# Altium schematic sheet 01-POWER.SchDoc: *NGUON4V4
size A3; SheetNumber: 2; SheetTotal: 7
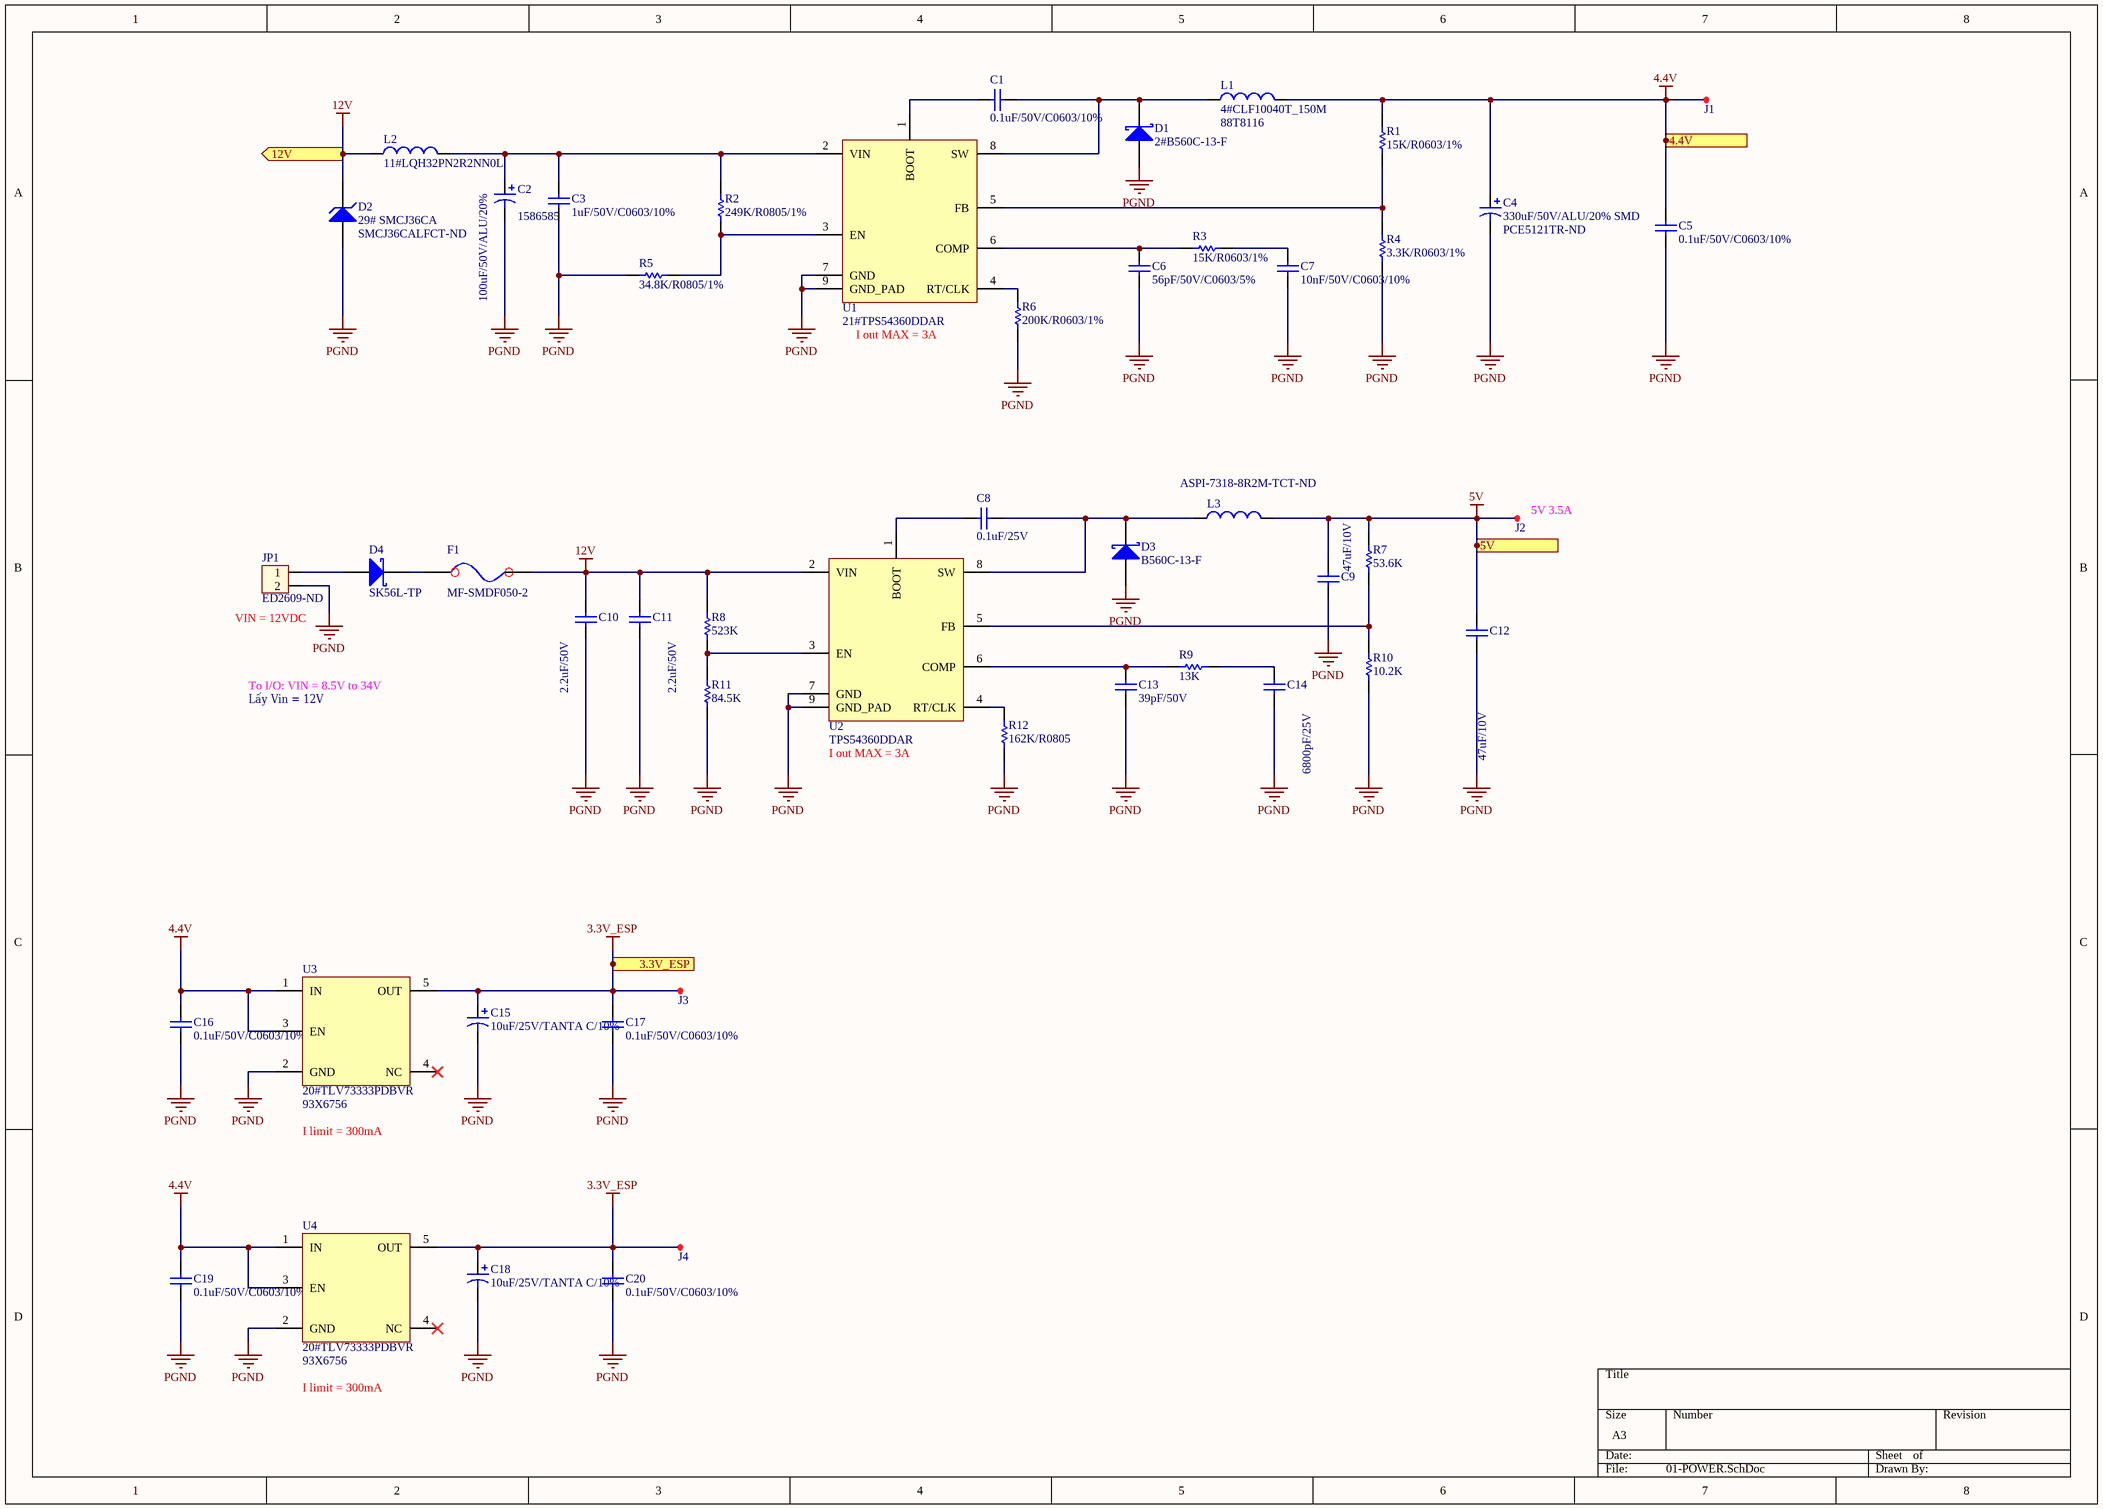
[diagram p0: 01-POWER.SchDoc]

## Parts
C1  0.1uF/50V/C0603/10%  [Cap Ceramic 0603 SMD]
C2  100uF/50V/ALU/20%  Supplier Part Number 1: 1586585  [CAP ALU CASE F SMD]
C3  1uF/50V/C0603/10%  [Cap Ceramic 0603 SMD]
C4  330uF/50V/ALU/20% SMD  Supplier Part Number 1: PCE5121TR-ND  [CAP ALU CASE G SMD]
C5  0.1uF/50V/C0603/10%  [Cap Ceramic 0603 SMD]
C6  56pF/50V/C0603/5%  [Cap Ceramic 0603 SMD]
C7  10nF/50V/C0603/10%  [Cap Ceramic 0603 SMD]
C8  0.1uF/25V  [CAP_CERA_C2012(CC0805INCH)]
C9  47uF/10V  [CAP_CERA_C2012(CC0805INCH)]
C10  2.2uF/50V  [CAP_CERA_C2012(CC0805INCH)]
C11  2.2uF/50V  [CAP_CERA_C2012(CC0805INCH)]
C12  47uF/10V  [CAP_CERA_C2012(CC0805INCH)]
C13  39pF/50V  [CAP_CERA_C2012(CC0805INCH)]
C14  6800pF/25V  [CAP_CERA_C2012(CC0805INCH)]
C15  10uF/25V/TANTA C/10%  [CAP TANT CASE C SMD]
C16  0.1uF/50V/C0603/10%  [Cap Ceramic 0603 SMD]
C17  0.1uF/50V/C0603/10%  [Cap Ceramic 0603 SMD]
C18  10uF/25V/TANTA C/10%  [CAP TANT CASE C SMD]
C19  0.1uF/50V/C0603/10%  [Cap Ceramic 0603 SMD]
C20  0.1uF/50V/C0603/10%  [Cap Ceramic 0603 SMD]
D1  2#B560C-13-F  [2# B560C]
D2  29# SMCJ36CA  Supplier Part Number 1: SMCJ36CALFCT-ND  [29# diode SMCJ36A]
D3  B560C-13-F  [2# B560C]
D4  SK56L-TP  [30# SK56L-TPMSCT-ND]
F1  MF-SMDF050-2  [13# MF-SMDF050]
J1  TEST POINT  [TEST POINT 1mm]  (value not drawn)
J2  TEST POINT  [TEST POINT 1mm]  (value not drawn)
J3  TEST POINT  [TEST POINT 1mm]  (value not drawn)
J4  TEST POINT  [TEST POINT 1mm]  (value not drawn)
JP1  ED2609-ND  [DOMINO_OSTTC_2P]
L1  4#CLF10040T_150M  Supplier Part Number 1: 88T8116  [4# clf10040XX]
L2  11#LQH32PN2R2NN0L  [11# LQH32PN2R2]
L3  ASPI-7318-8R2M-TCT-ND  [ASPI-7318-8R2M-TCT-ND]
R1  15K/R0603/1%  [Res 0603 SMD]
R2  249K/R0805/1%  [Res 0805 SMD]
R3  15K/R0603/1%  [Res 0603 SMD]
R4  3.3K/R0603/1%  [Cap Ceramic 0603 SMD]
R5  34.8K/R0805/1%  [Res 0805 SMD]
R6  200K/R0603/1%  [Res 0603 SMD]
R7  53.6K  [Res 0805 SMD]
R8  523K  [Res 0805 SMD]
R9  13K  [Res 0805 SMD]
R10  10.2K  [Res 0805 SMD]
R11  84.5K  [Res 0805 SMD]
R12  162K/R0805  [Res 0805 SMD]
U1  21#TPS54360DDAR  [21# TPS54360]
U2  TPS54360DDAR  [21# TPS54360]
U3  20#TLV73333PDBVR  Supplier Part Number 1: 93X6756  [TLV73333PDBVR - SOT23-65]
U4  20#TLV73333PDBVR  Supplier Part Number 1: 93X6756  [TLV73333PDBVR - SOT23-65]

## Ports
3.3V_ESP (out), 4.4V (out), 5V (out), 12V (out)

## Nets
3.3V_ESP: C15.1 C17.2 C18.1 C20.2 J3.1(TP) J4.1(TP) U3.5(OUT) U4.5(OUT) ; port 3.3V_ESP
4.4V: C4.1 C5.2 C16.2 C19.2 J1.1(TP) L1.2 R1.2 U3.1(IN) U3.3(EN) U4.1(IN) U4.3(EN) ; port 4.4V
5V: C9.2 C12.2 J2.1(TP) L3.2 R7.2 ; port 5V
12V: C10.2 C11.2 D2.2(K) F1.2(OUT) L2.1 R8.2 U2.2(VIN) ; port 12V
PGND: C2.2 C3.1 C4.2 C5.1 C6.1 C7.1 C9.1 C10.1 C11.1 C12.1 C13.1 C14.1 C15.2 C16.1 C17.1 C18.2 C19.1 C20.1 D1.1(A) D2.1(A) D3.1(A) JP1.2 R4.1 R5.1 R6.2 R10.1 R11.1 R12.2 U1.7(GND) U1.9(GND_PAD) U2.7(GND) U2.9(GND_PAD) U3.2(GND) U4.2(GND)
NetC1_1: C1.1 U1.1(BOOT)
NetC1_2: C1.2 D1.2(K) L1.1 U1.8(SW)
NetC2_1: C2.1 C3.2 L2.2 R2.2 U1.2(VIN)
NetC6_2: C6.2 R3.2 U1.6(COMP)
NetC7_2: C7.2 R3.1
NetC8_1: C8.1 D3.2(K) L3.1 U2.8(SW)
NetC8_2: C8.2 U2.1(BOOT)
NetC13_2: C13.2 R9.2 U2.6(COMP)
NetC14_2: C14.2 R9.1
NetD4_1: D4.1(A) JP1.1
NetD4_2: D4.2(K) F1.1(IN)
NetR1_1: R1.1 R4.2 U1.5(FB)
NetR2_1: R2.1 R5.2 U1.3(EN)
NetR6_1: R6.1 U1.4(RT/CLK)
NetR7_1: R7.1 R10.2 U2.5(FB)
NetR8_1: R8.1 R11.2 U2.3(EN)
NetR12_1: R12.1 U2.4(RT/CLK)

Not connected (* = marked no-connect by the designer): U3 4(NC)*; U4 4(NC)*

## Notes on the sheet
- (near U1) I out MAX = 3A
- (near J2) 5V 3.5A
- (near JP1) VIN = 12VDC
- To I/O: VIN = 8.5V to 34V
- Lấy Vin = 12V
- (near U2) I out MAX = 3A
- I limit = 300mA
- Title
- Size:
- Date:
- A3
- Number:
- Time:
- Revision:
- Sheet
- of
- File:

## Library data of the parts
C1 C5 C16 C17 C19 C20 = 0.1uF/50V/C0603/10%: CAP CER 0.1UF 50V 10% X7R 0603; Manufacturer: Murata Electronics North America; Manufacturer Part Number: GRM188R71H104KA93D; Capacitance: 0.1µF; RoHS: RoHS Compliant; Category: Capacitors; Packaging: Tape & Reel (TR); Tolerance: ±10%; Voltage - Rated: 50V; Temperature Coefficient: X7R; Mounting Type: Surface Mount, MLCC; Operating Temperature: -55°C ~ 125°C; Applications: General Purpose; Ratings: -; Package / Case: 0603 (1608 Metric); Size / Dimension: 0.063" L x 0.031" W (1.60mm x 0.80mm); Height - Seated (Max): -; Thickness (Max): 0.035" (0.90mm); Lead Spacing: -; Features: -; Lead Style: -; ComponentLink1URL: http://www.murata.com/~/media/webrenewal/support/library/catalog/products/capacitor/mlcc/c02e.ashx; ComponentLink1Description: http://www.murata.com/~/media/webrenewal/support/library/catalog/products/capacitor/mlcc/c02e.ashx; Supplier 1: Digi-Key; Supplier Part Number 1: 490-1519-1-ND
C2 = 100uF/50V/ALU 8X11.5/20%: CAP ALU 100UF 20% 50V RADIAL; Manufacturer: Panasonic Electronic Components; Manufacturer Part Number: ECA-1HM101B; Capacitance: 100µF; Lifetime @ Temp.: 2000 Hrs @ 85°C; Ripple Current: 250mA; RoHS: RoHS Compliant; Category: Capacitors; Packaging: Tape & Box (TB); Tolerance: ±20%; Voltage Rating: 50V; ESR (Equivalent Series Resistance): -; Operating Temperature: -40°C ~ 85°C; Type: -; Applications: General Purpose; Impedance: -; Lead Spacing: 0.197" (5.00mm); Size / Dimension: 0.315" Dia (8.00mm); Height - Seated (Max): 0.492" (12.50mm); Surface Mount Land Size: -; Mounting Type: Through Hole; Package / Case: Radial, Can; ComponentLink1URL: http://industrial.panasonic.com/www-cgi/jvcr13pz.cgi?E+PZ+3+ABA0012+ECA1HM101B+7+WW; ComponentLink1Description: http://industrial.panasonic.com/www-cgi/jvcr13pz.cgi?E+PZ+3+ABA0012+ECA1HM101B+7+WW; Supplier 1: Future Electronics
C3 = 1uF/50V/C0603/10%: CAP CER 1UF 50V X7R 0603; Manufacturer: Samsung Electro-Mechanics America, Inc.; Manufacturer Part Number: CL21B105KBFNNNE; Capacitance: 1µF; Tolerance: ±10%; RoHS: RoHS Compliant; Category: Capacitors; Packaging: Cut Tape (CT); Voltage - Rated: 50V; Temperature Coefficient: X7R; Mounting Type: Surface Mount, MLCC; Operating Temperature: -55°C ~ 125°C; Applications: General Purpose; Ratings: -; Package / Case: 0805 (2012 Metric); Size / Dimension: 0.079" L x 0.049" W (2.00mm x 1.25mm); Height - Seated (Max): -; Thickness (Max): 0.053" (1.35mm); Lead Spacing: -; Features: -; Lead Style: -; ComponentLink1URL: http://www.samsungsem.com/kr/support/product-search/mlcc/CL21B105KBFNNNE.jsp; ComponentLink1Description: http://www.samsungsem.com/kr/support/product-search/mlcc/CL21B105KBFNNNE.jsp; Supplier 1: Digi-Key; Supplier Part Number 1: 1276-1029-1-ND
C4 = 330uF/50V/ALU12.5X20mm/20%/7000Hrs: CAP ALU 330UF 20% 50V SMD; Manufacturer: Nichicon; Manufacturer Part Number: UPW1J331MHD; Lifetime @ Temp.: 7000 Hrs @ 105°C; Polarization: Polar; Ripple Current - Low Frequency: 838.5mA @ 120Hz; Ripple Current - High Frequency: 1.29A @ 100kHz; RoHS: RoHS Compliant; Category: Capacitors; Packaging: Bulk; Part Status: Active; Tolerance: ±20%; ESR (Equivalent Series Resistance): -; Operating Temperature: -55°C ~ 105°C; Applications: General Purpose; Lead Spacing: 0.197" (5.00mm); Size / Dimension: 0.492" Dia (12.50mm); Height - Seated (Max): 0.787" (20.00mm); Surface Mount Land Size: -; Mounting Type: Through Hole; Package / Case: Radial, Can; ComponentLink1URL: http://nichicon-us.com/english/products/pdfs/e-upw.pdf; ComponentLink1Description: http://nichicon-us.com/english/products/pdfs/e-upw.pdf; Supplier 1: Digi-Key
C6 = 56pF/50V/C0603/5%: Cap Ceramic 56pF 50V C0G 5% SMD 0603 125C Paper T/R; Manufacturer: Samsung; Manufacturer Part Number: CL10C560JB8NNNC; Temperature Coefficient: 30ppm/°C; Supplier 1: Digi-Key; Stock 1: 40000; Pricing 1: 1=0.1, 10=0.056, 100=0.0251, 500=0.0179, 1000=0.0141 (USD); Mount: Surface Mount; Case/Package: 0603; Case Code (Metric): 1608; Case Code (Imperial): 0603; Material: Ceramic; Min Operating Temperature: -55°C; Max Operating Temperature: 125°C; Capacitance: 56pF; Tolerance: 5%; Packaging: Tape and Reel; Voltage Rating: 50V; Package Quantity: 1; Dielectric: C0G; Voltage: 50V; Termination: SMD/SMT; Voltage Rating (DC): 50V; Length: 1.6mm; Height: 0.8mm; Width: 0.031inch; Thickness: 0.035inch; Depth: 0.8mm; Radiation Hardening: No; Lead Free: Lead Free; Supplier Part Number 1: 1276-1197-1-ND
C7 = 10nF/50V/C0603/10%: CAP CER 10000PF 50V X7R 0603; Manufacturer: Murata Electronics North America; Manufacturer Part Number: GRM188R71H103KA01D; Tolerance: ±10%; RoHS: RoHS Compliant; Category: Capacitors; Packaging: Cut Tape (CT); Capacitance: 10000pF; Voltage - Rated: 50V; Temperature Coefficient: X7R; Mounting Type: Surface Mount, MLCC; Operating Temperature: -55°C ~ 125°C; Applications: General Purpose; Ratings: -; Package / Case: 0603 (1608 Metric); Size / Dimension: 0.063" L x 0.031" W (1.60mm x 0.80mm); Height - Seated (Max): -; Thickness (Max): 0.035" (0.90mm); Lead Spacing: -; Features: -; Lead Style: -; ComponentLink1URL: http://www.murata.com/~/media/webrenewal/support/library/catalog/products/capacitor/mlcc/c02e.ashx; ComponentLink1Description: http://www.murata.com/~/media/webrenewal/support/library/catalog/products/capacitor/mlcc/c02e.ashx; Supplier 1: Digi-Key; Supplier Part Number 1: 490-1512-1-ND
C8 = 0.1uF/50V/C0603/10%: 0.1µF ±10% 25V Ceramic Capacitor X7R 0805 (2012 Metric); Manufacturer: AVX Corporation; ComponentLink1URL: http://www.murata.com/~/media/webrenewal/support/library/catalog/products/capacitor/mlcc/c02e.ashx; ComponentLink1Description: http://www.murata.com/~/media/webrenewal/support/library/catalog/products/capacitor/mlcc/c02e.ashx; Digikey: 478-3755-1-ND
C9 C12 = 0.1uF/50V/C0603/10%: 47µF ±20% 10V Ceramic Capacitor X5R 0805 (2012 Metric); Manufacturer: Murata; ComponentLink1URL: http://www.murata.com/~/media/webrenewal/support/library/catalog/products/capacitor/mlcc/c02e.ashx; ComponentLink1Description: http://www.murata.com/~/media/webrenewal/support/library/catalog/products/capacitor/mlcc/c02e.ashx; Digikey: 490-9961-1-ND
C10 C11 = 1uF/50V/C0603/10%: 2.2µF ±10% 50V Ceramic Capacitor JB 0805 (2012 Metric); Manufacturer: TDK; ComponentLink1URL: http://www.samsungsem.com/kr/support/product-search/mlcc/CL21B105KBFNNNE.jsp; ComponentLink1Description: http://www.samsungsem.com/kr/support/product-search/mlcc/CL21B105KBFNNNE.jsp; Digikey: 445-11501-1-ND
C13 = 56pF/50V/C0603/5%: 39pF ±10% 50V Ceramic Capacitor C0G, NP0 0805 (2012 Metric); Manufacturer: KEMET; Digikey: 399-9232-1-ND
C14 = 10nF/50V/C0603/10%: 6800pF ±10% 25V Ceramic Capacitor X7R 0805 (2012 Metric); Manufacturer: Wurth Electronics Inc.; ComponentLink1URL: http://www.murata.com/~/media/webrenewal/support/library/catalog/products/capacitor/mlcc/c02e.ashx; ComponentLink1Description: http://www.murata.com/~/media/webrenewal/support/library/catalog/products/capacitor/mlcc/c02e.ashx; Digikey: 732-8054-1-ND
C15 C18 = TAJB106M025RNJ: Tantalum Capacitors - Solid SMD 25v 10uF 20%Tol Code C; Manufacturer: Kyocera AVX; Tolerance: 20%; ESR (Equivalent Series Resistance): 2.5R; Leakage Current: 2.5uA; Polarity: Polar; Dissipation Factor: 6%; Supplier 1: Digi-Key; Manufacturer Part Number: TAJB106M025RNJ; Stock 1: 10615; Pricing 1: 1=0.74, 10=0.524, 100=0.3453, 500=0.2558, 1000=0.2174 (USD); Mount: Surface Mount; Case/Package: 1210; Weight: 0.000564oz; Case Code (Metric): 3528; Case Code (Imperial): 1210; Min Operating Temperature: -55°C; Max Operating Temperature: 125°C; Packaging: Tape and Reel; Capacitance: 10uF; Voltage Rating: 25V; Package Quantity: 2000; Termination: SMD/SMT; Voltage Rating (DC): 25V; Features: General Purpose; Length: 3.5mm; Height: 2.1mm; Width: 0.11inch; Height - Seated (Max): 0.083inch; Depth: 2.8mm; Lead Free: Lead Free; Supplier Part Number 1: 478-8887-1-ND
D1 = 2#B560C-13-F: DIODE SCHOTTKY 60V 5A SMC; Manufacturer: Diodes; Peak Reverse Current: 500uA; Forward Voltage: 700mV; Max Forward Surge Current (Ifsm): 100A; Element Configuration: Single; Polarity: Standard; Capacitance: 300pF; Supplier 1: Digi-Key; Manufacturer Part Number: B560C-13-F; Stock 1: 183351; Pricing 1: 1=0.55, 10=0.467, 100=0.349, 500=0.2742, 1000=0.2119 (USD); Mount: Surface Mount; Case/Package: SMC; Number of Pins: 2; Weight: 0.007408oz; Contact Plating: Matte,Tin; Min Operating Temperature: -55°C; Max Operating Temperature: 125°C; Package Quantity: 3000; Packaging: Tape and Reel; Forward Current: 5A; Max Repetitive Reverse Voltage (Vrrm): 60V; Average Rectified Current: 5A; Peak Non-Repetitive Surge Current: 100A; Termination: SMD/SMT; Voltage Rating (DC): 60V; Current Rating: 5A; Output Current: 5A; Max Reverse Voltage (DC): 60V; Length: 7.11mm; Height: 2.5mm; Width: 6.22mm; Radiation Hardening: No; REACH SVHC: No SVHC; Lead Free: Lead Free; Supplier Part Number 1: B560C-FDICT-ND
D2 = 29# SMCJ36CA: TVS DIODE 36VWM 58.1VC SMC; Manufacturer: Littelfuse; Direction: Bidirectional; Reverse Breakdown Voltage: 40V; Operating Supply Voltage: 36V; Max Surge Current: 25.9A; Number of Bidirectional Channels: 1; Clamping Voltage: 58.1V; Peak Pulse Power: 1.5kW; Power Line Protection: No; Test Current: 1mA; Max Breakdown Voltage: 44.2V; Max Power Dissipation: 6.5W; Leakage Current: 1uA; Supplier 1: Digi-Key; Manufacturer Part Number: SMCJ36CA; Stock 1: 75326; Pricing 1: 1=0.7, 10=0.587, 25=0.514, 100=0.4406, 250=0.3818, 500=0.3231, 1000=0.2497 (USD); Mount: Surface Mount; Number of Pins: 2; Min Operating Temperature: -55°C; Max Operating Temperature: 150°C; Package Quantity: 3000; Packaging: Tape and Reel; Reverse Standoff Voltage: 36V; Min Breakdown Voltage: 40V; Breakdown Voltage: 40V; Number of Channels: 1; Polarity: Bidirectional; Termination: SMD/SMT; Number of Elements: 1; Peak Pulse Current: 25.9A; Power Dissipation: 1.5kW; Voltage Rating (DC): 36V; Composition: Zener; Length: 8.13mm; Height: 2.62mm; Width: 6.22mm; Radiation Hardening: No; REACH SVHC: No SVHC; Lead Free: Lead Free
D3 = 2#B560C-13-F: DIODE SCHOTTKY 60V 5A SMC; Digikey: B560C-FDICT-ND
D4 = 30# SK56L-TP: DIODE SCHOTTKY 60V 5A DO214AB; ComponentLink1URL: http://www.mccsemi.com/up_pdf/SK52L-SK510L(DO-214AB).PDF; ComponentLink1Description: http://www.mccsemi.com/up_pdf/SK52L-SK510L(DO-214AB).PDF; Digikey: SK56L-TPMSCT-ND
F1 = 13#MF-SMDF050-2: PTC RESET FUSE 60V 550MA 2018; Digikey: MF-SMDF050-2CT-ND
J1-J4 = PAD 1mm: TPoint
JP1 = Con2: 2 Position Wire to Board Terminal Block Horizontal with Board 0.200" (5.08mm) Through Hole; Value: Connector 2; Digikey: ED2609-ND
L1 = 4#CLF10040T_150M: FIXED IND 15uH 3.2A 40 MOHM (10.0×9.7×3.8); Supplier 1: Newark
L2 = 11#LQH32PN2R2NN0L: Inductor Power Chip Shielded Wirewound 2.2uH 30% 1MHz Ferrite 1.6A 91.2mOhm DCR 1210 Embossed T/R; Manufacturer: Murata; Self Resonant Frequency: 70MHz; Saturation Current: 1.55A; DC Resistance (DCR): 76mR; Supplier 1: Digi-Key; Manufacturer Part Number: LQH32PN2R2NN0L; Stock 1: 21482; Pricing 1: 1=0.41, 10=0.361, 100=0.2483, 500=0.2122, 1000=0.1625 (USD); Mount: Surface Mount; Case/Package: 1210; Weight: 0.001552oz; Core Material: Ferrite; Case Code (Metric): 3225; Case Code (Imperial): 1210; Min Operating Temperature: -40°C; Max Operating Temperature: 85°C; Tolerance: 30%; Packaging: Tape and Reel; Shielding: Shielded; Package Quantity: 1; Current Rating: 1.6A; Inductance: 2.2uh; Max DC Current: 1.55A; Termination: SMD/SMT; Composition: Wirewound; Test Frequency: 1MHz; DC Current: 1.6A; Military Standard: Not; Inductance Tolerance: 30%; Length: 3.2mm; Height: 2mm; Width: 2.5mm; Height - Seated (Max): 0.067inch; Depth: 2.8mm; Radiation Hardening: No; REACH SVHC: No SVHC; Lead Free: Lead Free; Supplier Part Number 1: 490-5336-1-ND
L3 = Inductor: 8.2µH Shielded Wirewound Inductor 4A 68 mOhm Max Nonstandard; Digikey: ASPI-7318-8R2M-TCT-ND
R1 R3 = 15K/R0603/1%: RES SMD 15K OHM 1% 1/10W 0603; Manufacturer: Yageo; Manufacturer Part Number: RC0603FR-0715KL; Power (Watts): 0.1W, 1/10W; Temperature Coefficient: ±100ppm/°C; RoHS: RoHS Compliant; Category: Resistors; Packaging: Digi-Reel®; Resistance (Ohms): 15k; Tolerance: ±1%; Composition: Thick Film; Features: Moisture Resistant; Operating Temperature: -55°C ~ 155°C; Package / Case: 0603 (1608 Metric); Supplier Device Package: 0603; Size / Dimension: 0.063" L x 0.031" W (1.60mm x 0.80mm); Height: 0.022" (0.55mm); Number of Terminations: 2; ComponentLink1URL: http://www.yageo.com/NewPortal/yageodocoutput?fileName=/pdf/R-Chip/PYu-RC_Group_51_RoHS_L_3.pdf; ComponentLink1Description: http://www.yageo.com/NewPortal/yageodocoutput?fileName=/pdf/R-Chip/PYu-RC_Group_51_RoHS_L_3.pdf; Supplier 1: Digi-Key; Supplier Part Number 1: 311-15.0KHRCT-ND
R2 = 249K/R0805/1%: RES SMD 249K OHM 1% 1/10W 0805; Manufacturer: Yageo; Manufacturer Part Number: RC0603FR-07249KL; Power (Watts): 0.1W, 1/10W; Temperature Coefficient: ±100ppm/°C; Supplier 1: Digi-Key; RoHS: RoHS Compliant; Category: Resistors; Stock 1: 370515; Pricing 1: 1=0.1, 10=0.015, 100=0.006, 1000=0.00268, 2500=0.00233 (USD); Packaging: Cut Tape (CT); Part Status: Active; Tolerance: ±1%; Composition: Thick Film; Features: Moisture Resistant; Operating Temperature: -55°C ~ 155°C; Package / Case: 0603 (1608 Metric); Supplier Device Package: 0603; Size / Dimension: 0.063" L x 0.032" W (1.60mm x 0.80mm); Height - Seated (Max): 0.022" (0.55mm); Failure Rate: -; ComponentLink1URL: http://www.yageo.com/documents/recent/PYu-RC_Group_51_RoHS_L_8.pdf; ComponentLink1Description: http://www.yageo.com/documents/recent/PYu-RC_Group_51_RoHS_L_8.pdf
R4 = 3.3K/R0603/1%: RES SMD 3.3K OHM 1% 1/10W 0603; Manufacturer: Yageo; Manufacturer Part Number: RC0603FR-073K3L; Power (Watts): 0.1W, 1/10W; Temperature Coefficient: ±100ppm/°C; RoHS: RoHS Compliant; Category: Resistors; Packaging: Digi-Reel®; Resistance (Ohms): 3.3k; Tolerance: ±1%; Composition: Thick Film; Features: Moisture Resistant; Operating Temperature: -55°C ~ 155°C; Package / Case: 0603 (1608 Metric); Supplier Device Package: 0603; Size / Dimension: 0.063" L x 0.031" W (1.60mm x 0.80mm); Height: 0.022" (0.55mm); Number of Terminations: 2; ComponentLink1URL: http://www.yageo.com/NewPortal/yageodocoutput?fileName=/pdf/R-Chip/PYu-RC_Group_51_RoHS_L_3.pdf; ComponentLink1Description: http://www.yageo.com/NewPortal/yageodocoutput?fileName=/pdf/R-Chip/PYu-RC_Group_51_RoHS_L_3.pdf; Supplier 1: Digi-Key; Supplier Part Number 1: 311-3.30KHRCT-ND
R5 = 34.8K/R0805/1%: Thick Film Resistors - SMD 34.8K OHM 1% 0805; Manufacturer: Yageo; Manufacturer Part Number: RC0603FR-0734K8L; Power Rating: 100mW; Resistance: 34.8kR; Voltage Rating: 50V; Temperature Coefficient: 100ppm/°C; Supplier 1: Digi-Key; Stock 1: 82861; Pricing 1: 1=0.1, 10=0.026, 100=0.0107, 1000=0.0048, 2500=0.0042 (USD); Case/Package: 0603; Case Code (Imperial): 0603; Case Code (Metric): 1608; Min Operating Temperature: -55°C; Max Operating Temperature: 155°C; Tolerance: 1%; Packaging: Tape and Reel; Termination: SMD/SMT; Composition: Thick Film; Military Standard: Not; Voltage Rating (DC): 50V; Length: 1.6mm; Height: 0.45mm; Width: 0.8mm; Depth: 0.8mm; Lead Free: Lead Free; Supplier Part Number 1: 311-34.8KHRCT-ND
R6 = 200K/R0603/1%: RES SMD 200K OHM 1% 1/10W 0603; Manufacturer: Yageo; Manufacturer Part Number: RC0603FR-07200KL; Power (Watts): 0.1W, 1/10W; Temperature Coefficient: ±100ppm/°C; Supplier 1: Digi-Key; RoHS: RoHS Compliant; Category: Resistors; Stock 1: 924437; Pricing 1: 1=0.1, 10=0.015, 100=0.006, 1000=0.00268, 2500=0.00233 (USD); Packaging: Cut Tape (CT); Part Status: Active; Tolerance: ±1%; Composition: Thick Film; Features: Moisture Resistant; Operating Temperature: -55°C ~ 155°C; Package / Case: 0603 (1608 Metric); Supplier Device Package: 0603; Size / Dimension: 0.063" L x 0.031" W (1.60mm x 0.80mm); Height - Seated (Max): 0.022" (0.55mm); Failure Rate: -; ComponentLink1URL: http://www.yageo.com/documents/recent/PYu-RC_Group_51_RoHS_L_7.pdf; ComponentLink1Description: http://www.yageo.com/documents/recent/PYu-RC_Group_51_RoHS_L_7.pdf; Supplier Part Number 1: 311-200KHRCT-ND
R7 = 15K/R0603/1%: 53.6 kOhms ±1% 0.125W, 1/8W Chip Resistor 0805 (2012 Metric) Automotive AEC-Q200 Thick Film; ComponentLink1URL: http://www.yageo.com/NewPortal/yageodocoutput?fileName=/pdf/R-Chip/PYu-RC_Group_51_RoHS_L_3.pdf; ComponentLink1Description: http://www.yageo.com/NewPortal/yageodocoutput?fileName=/pdf/R-Chip/PYu-RC_Group_51_RoHS_L_3.pdf; Digikey: 541-53.6KCCT-ND
R8 = 249K/R0805/1%: 523 kOhms ±1% 0.125W, 1/8W Chip Resistor 0805 (2012 Metric) Automotive AEC-Q200 Thick Film; ComponentLink1URL: http://www.yageo.com/documents/recent/PYu-RC_Group_51_RoHS_L_8.pdf; ComponentLink1Description: http://www.yageo.com/documents/recent/PYu-RC_Group_51_RoHS_L_8.pdf; Digikey: 541-523KCCT-ND
R9 = 15K/R0603/1%: 13 kOhms ±1% 0.125W, 1/8W Chip Resistor 0805 (2012 Metric) Automotive AEC-Q200 Thick Film; ComponentLink1URL: http://www.yageo.com/NewPortal/yageodocoutput?fileName=/pdf/R-Chip/PYu-RC_Group_51_RoHS_L_3.pdf; ComponentLink1Description: http://www.yageo.com/NewPortal/yageodocoutput?fileName=/pdf/R-Chip/PYu-RC_Group_51_RoHS_L_3.pdf; Digikey: 541-13.0KCCT-ND
R10 = 3.3K/R0603/1%: 10.2 kOhms ±1% 0.125W, 1/8W Chip Resistor 0805 (2012 Metric) Automotive AEC-Q200 Thick Film; ComponentLink1URL: http://www.yageo.com/NewPortal/yageodocoutput?fileName=/pdf/R-Chip/PYu-RC_Group_51_RoHS_L_3.pdf; ComponentLink1Description: http://www.yageo.com/NewPortal/yageodocoutput?fileName=/pdf/R-Chip/PYu-RC_Group_51_RoHS_L_3.pdf; Digikey: 541-10.0KCCT-ND
R11 = 34.8K/R0805/1%: 84.5 kOhms ±1% 0.125W, 1/8W Chip Resistor 0805 (2012 Metric) Automotive AEC-Q200 Thick Film; Digikey: 541-84.5KCCT-ND
R12 = 200K/R0603/1%: 162 kOhms ±1% 0.125W, 1/8W Chip Resistor 0805 (2012 Metric) Automotive AEC-Q200 Thick Film; ComponentLink1URL: http://www.yageo.com/documents/recent/PYu-RC_Group_51_RoHS_L_7.pdf; ComponentLink1Description: http://www.yageo.com/documents/recent/PYu-RC_Group_51_RoHS_L_7.pdf; Digikey: 541-162KCCT-ND
U1 = 21#TPS54360DDAR: Voltage Regulators - Switching Regulators 60 Vin,3.5 A,SD DC-DC Converter; Manufacturer: Texas Instruments; Output Current: 3.5A; Min Input Voltage: 4.5V; Number of Outputs: 1; Max Input Voltage: 60V; Output Voltage: 58.8V; Switching Frequency: 2.5MHz; Synchronous Rectifier: Yes; Min Output Voltage: 800mV; Quiescent Current: 146uA; Output Type: Adjustable; Output Configuration: Positive; Supplier 1: Digi-Key; Manufacturer Part Number: TPS54360DDAR; Stock 1: 40955; Pricing 1: 1=4.32, 10=3.883, 100=3.1815, 500=2.7083, 1000=2.2841 (USD); Mount: Surface Mount; Number of Pins: 8; Contact Plating: Gold; Min Operating Temperature: -40°C; Max Operating Temperature: 125°C; Packaging: Tape and Reel; Package Quantity: 2500; Max Output Current: 3.5A; Max Output Voltage: 58.8V; Operating Supply Voltage: 60V; Radiation Hardening: No; REACH SVHC: No SVHC; Lead Free: Lead Free; Supplier Part Number 1: 296-37676-1-ND; Case/Package: DDA R-PDSO-G8
U2 = 21#TPS54360DDAR: Buck, Split Rail Switching Regulator IC Positive Adjustable 0.8V 1 Output 3.5A 8-PowerSOIC (0.154", 3.90mm Width); Digikey: 296-37676-1-ND
U3 U4 = 20#TLV73333PDBVR: LDO Regulator Pos 3.3V 0.3A 5-Pin SOT-23 T/R; Manufacturer: Texas Instruments; Number of Outputs: 1; Min Input Voltage: 1.4V; Max Input Voltage: 5.5V; Max Output Current: 300mA; Dropout Voltage: 125mV; Min Current Limit: 360mA; Polarity: Positive; Quiescent Current: 60uA; Accuracy: 1%; Output Type: Fixed; Manufacturer Part Number: TLV73333PDBVR; Mount: Surface Mount; Case/Package: SOT-23-5; Number of Pins: 5; Weight: 0.000557oz; Contact Plating: Gold; Min Operating Temperature: -40°C; Max Operating Temperature: 125°C; Packaging: Tape and Reel; Output Voltage: 3.3V; Output Current: 300mA; Number of Regulators: 1; Package Quantity: 3000; Radiation Hardening: No; Lead Free: Lead Free; Supplier 1: Newark